# EAGLE design Filtering_stages (EAGLE 7.4.0)
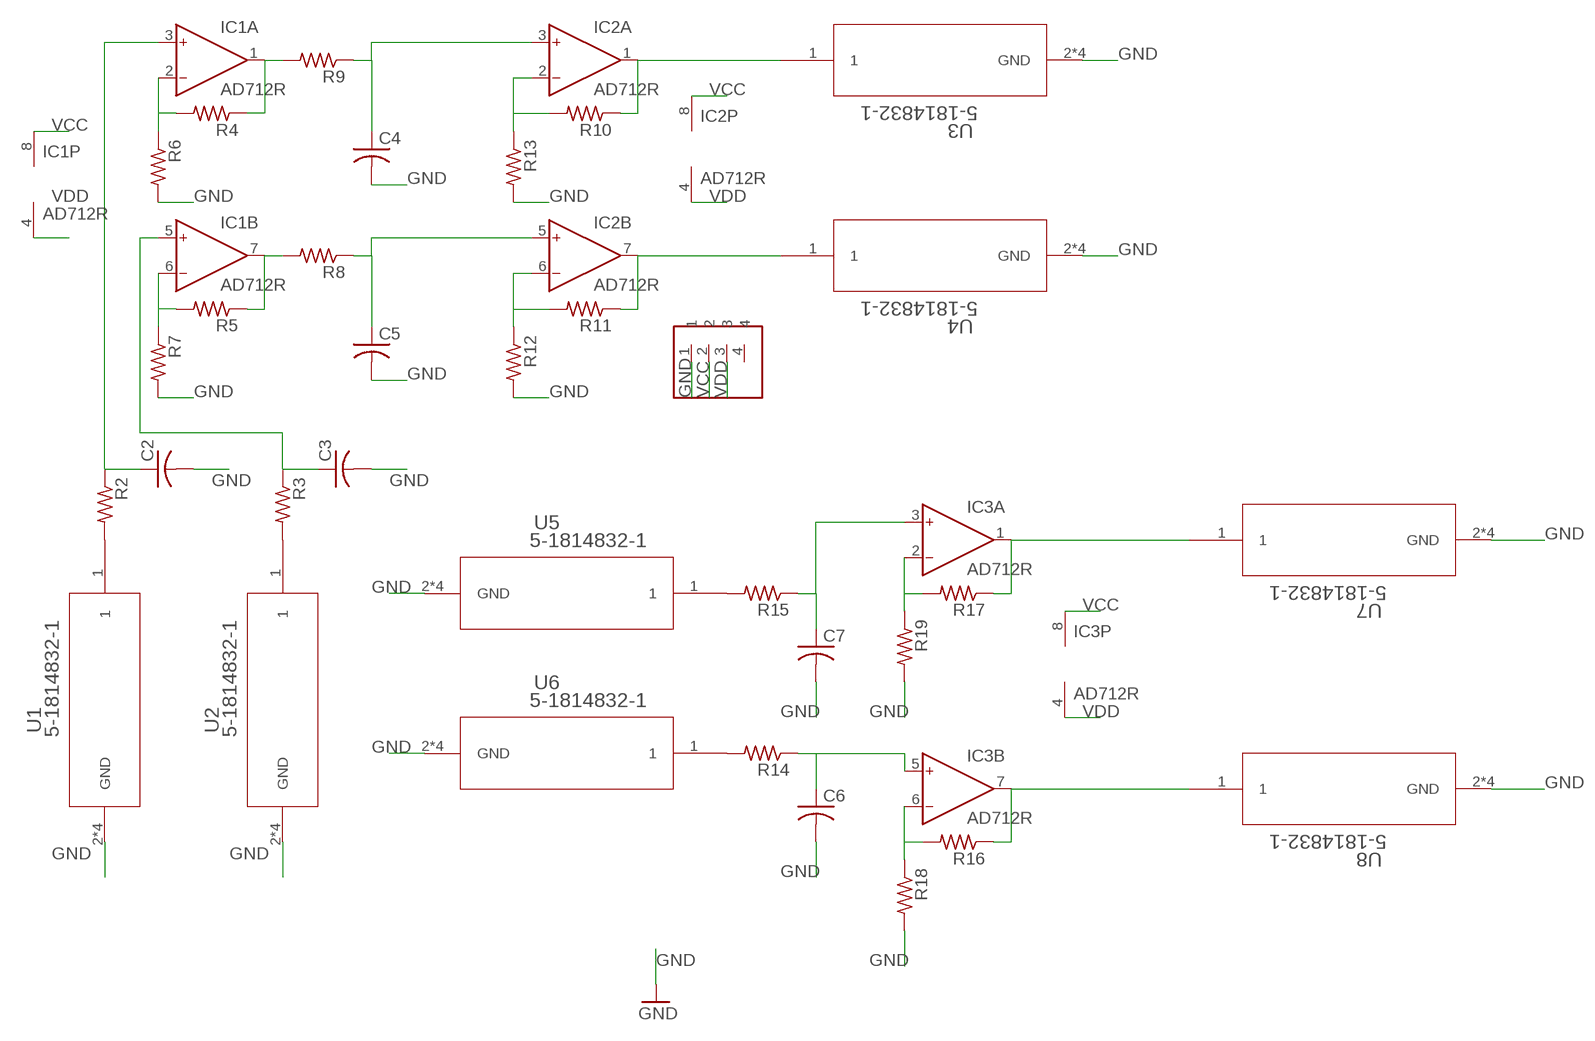
[diagram p0: schematic, sheet 1]

## Parts
C2  C-US025-025X050  [C025-025X050]
C3  C-US025-025X050  [C025-025X050]
C4  C-US025-025X050  [C025-025X050]
C5  C-US025-025X050  [C025-025X050]
C6  C-US025-025X050  [C025-025X050]
C7  C-US025-025X050  [C025-025X050]
IC1  AD712R  [SO8]
IC2  AD712R  [SO8]
IC3  AD712R  [SO8]
R2  R-US_0204/7  [0204/7]
R3  R-US_0204/7  [0204/7]
R4  R-US_0204/7  [0204/7]
R5  R-US_0204/7  [0204/7]
R6  R-US_0204/7  [0204/7]
R7  R-US_0204/7  [0204/7]
R8  R-US_0204/7  [0204/7]
R9  R-US_0204/7  [0204/7]
R10  R-US_0204/7  [0204/7]
R11  R-US_0204/7  [0204/7]
R12  R-US_0204/7  [0204/7]
R13  R-US_0204/7  [0204/7]
R14  R-US_0204/7  [0204/7]
R15  R-US_0204/7  [0204/7]
R16  R-US_0204/7  [0204/7]
R17  R-US_0204/7  [0204/7]
R18  R-US_0204/7  [0204/7]
R19  R-US_0204/7  [0204/7]
U1  5-1814832-1  [5-1814832-1]
U2  5-1814832-1  [5-1814832-1]
U3  5-1814832-1  [5-1814832-1]
U4  5-1814832-1  [5-1814832-1]
U5  5-1814832-1  [5-1814832-1]
U6  5-1814832-1  [5-1814832-1]
U7  5-1814832-1  [5-1814832-1]
U8  5-1814832-1  [5-1814832-1]
U$1  ED2582-ND  [ED2582-ND]

## Nets
GND: C2.2 C3.2 C4.2 C5.2 C6.2 C7.2 R6.2 R7.2 R12.2 R13.2 R18.2 R19.2 U1.2(GND) U1.3(GND) U1.4(GND) U1.5(GND) U2.2(GND) U2.3(GND) U2.4(GND) U2.5(GND) U3.2(GND) U3.3(GND) U3.4(GND) U3.5(GND) U4.2(GND) U4.3(GND) U4.4(GND) U4.5(GND) U5.2(GND) U5.3(GND) U5.4(GND) U5.5(GND) U6.2(GND) U6.3(GND) U6.4(GND) U6.5(GND) U7.2(GND) U7.3(GND) U7.4(GND) U7.5(GND) U8.2(GND) U8.3(GND) U8.4(GND) U8.5(GND) U$1.1
N$3: R2.2 U1.1
N$4: R3.2 U2.1
N$5: C2.1 IC1.3(A:IN+) R2.1
N$6: C3.1 IC1.5(B:IN+) R3.1
N$7: IC1.6(B:IN-) R5.2 R7.1
N$8: IC1.7(B:OUT) R5.1 R8.2
N$9: IC1.1(A:OUT) R4.1 R9.2
N$10: IC1.2(A:IN-) R4.2 R6.1
N$11: C4.1 IC2.3(A:IN+) R9.1
N$12: IC2.2(A:IN-) R10.2 R13.1
N$13: IC2.6(B:IN-) R11.2 R12.1
N$14: IC2.1(A:OUT) R10.1 U3.1
N$15: IC2.7(B:OUT) R11.1 U4.1
N$16: C5.1 IC2.5(B:IN+) R8.1
N$17: R14.2 U6.1
N$18: R15.2 U5.1
N$19: C7.1 IC3.3(A:IN+) R15.1
N$20: IC3.2(A:IN-) R17.2 R19.1
N$21: IC3.1(A:OUT) R17.1 U7.1
N$22: C6.1 IC3.5(B:IN+) R14.1
N$23: IC3.6(B:IN-) R16.2 R18.1
N$24: IC3.7(B:OUT) R16.1 U8.1
VCC: IC1.8(P:V+) IC2.8(P:V+) IC3.8(P:V+) U$1.2
VDD: IC1.4(P:V-) IC2.4(P:V-) IC3.4(P:V-) U$1.3
Unconnected: U$1.4

## Library data of the parts
C2-C7 = rcl:C-US: CAPACITOR, American symbol
IC1-IC3 = analog-devices:AD712: Dual Precision, Low Cost, High Speed BiFET Op Amp Source: http://www.analog.com/static/imported-files/data_sheets/AD712.pdf; MF: ALTERA CORPORATION; MPN: AD712KRZ; OC_FARNELL: 1263975; OC_NEWARK: 59K4556
R2-R19 = resistor:R-US_: RESISTOR, American symbol
U1-U8 = untitled:5-1814832-1; COPYRIGHT: Copyright (C) 2015 Accelerated Designs. All rights reserved; MANUFACTURER_PART_NUMBER: 5-1814832-1; VENDOR: Tyco Electronics
U$1 = addin:ED2582-ND

## Board
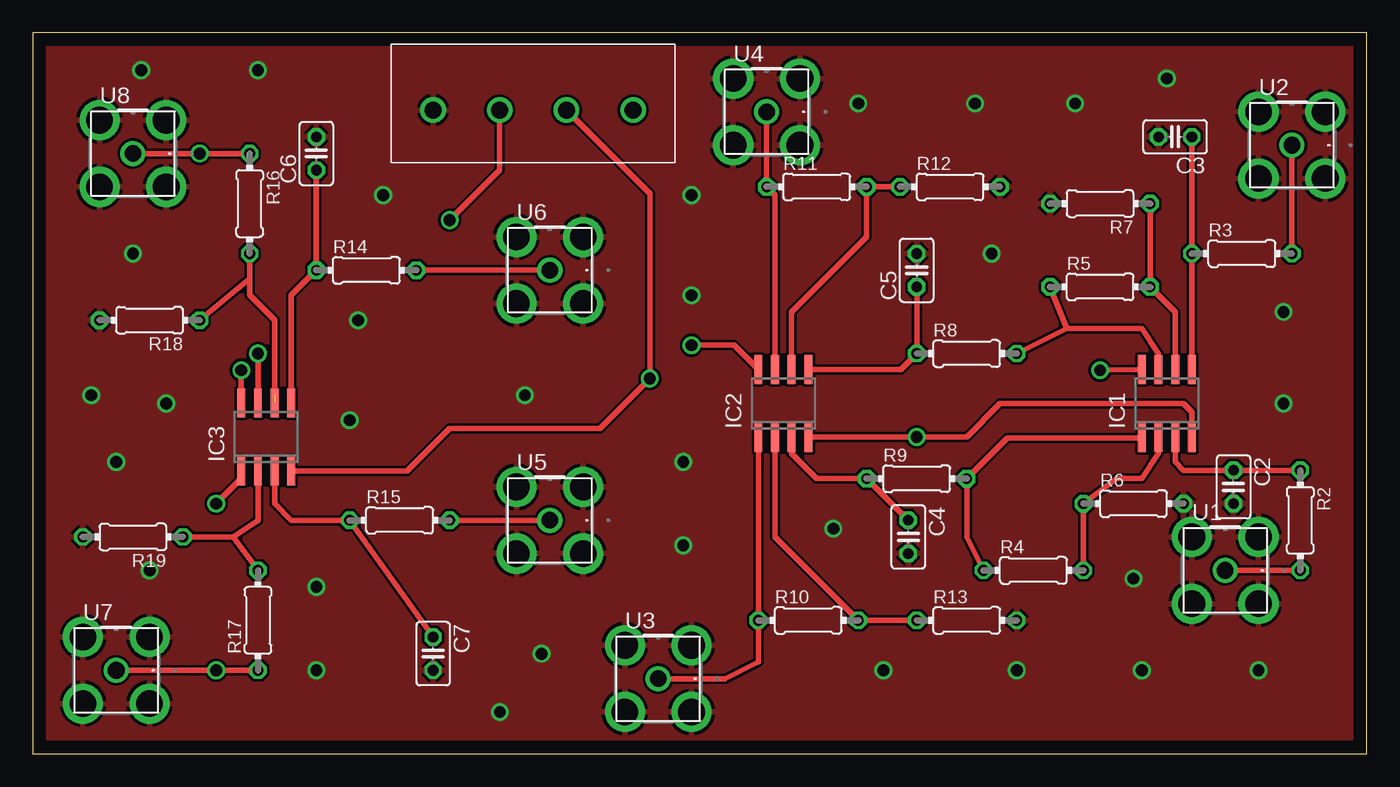
[diagram p1: board, top side]
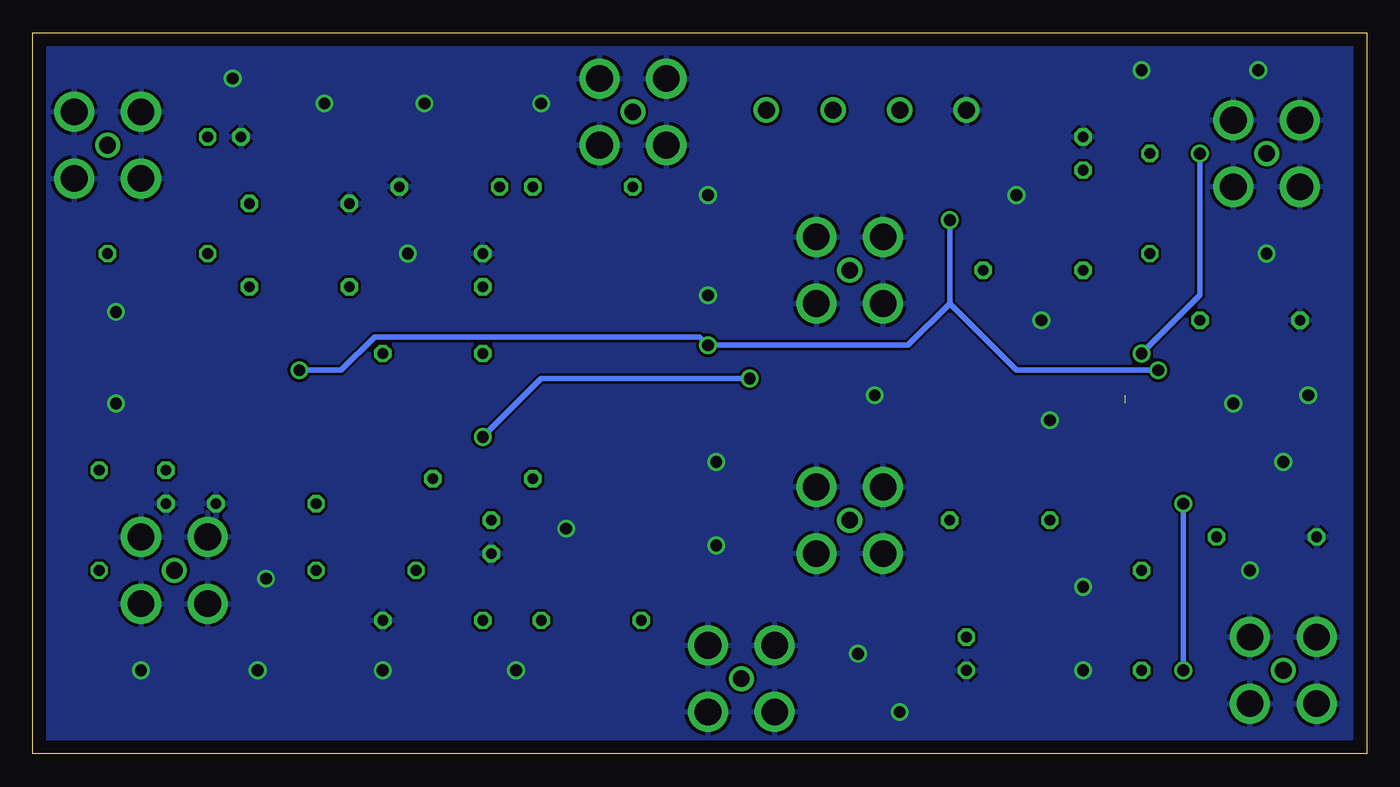
[diagram p2: board, bottom side, seen from below]

Size 101.58 x 54.91 mm. Coordinates in mm from the lower left corner, seen from the top.
Outline: 0,0 101.58,0 101.58,54.91 0,54.91 0,0
Copper layers (1*16): Top 0.035mm / dielectric 1.5mm / Bottom 0.035mm
Design rules "default": minimum track width 10mil, minimum drill 24mil, track to track 8mil, track to pad 8mil, pad to pad 8mil, via to via 8mil, smd to smd 8mil, copper to edge 40mil, drill to drill 8mil, minimum pad ring 10mil, minimum via ring 8mil, stop-mask expansion 4mil, vias tented up to drill 0mil, thermal gap 10mil

### Footprints (pad centres in the part's own frame; a part is rotated, then mirrored left to right if it is on the bottom)
C025-025X050 = drill 0.813 octagon: 1 -1.27,0; 2 1.27,0
SO8 = smd 0.6 x 2.2: 1 -1.905,-2.6; 2 -0.635,-2.6; 3 0.635,-2.6; 4 1.905,-2.6; 5 1.905,2.6; 6 0.635,2.6; 7 -0.635,2.6; 8 -1.905,2.6
0204/7 = drill 0.813 octagon: 1 -3.81,0; 2 3.81,0
5-1814832-1 = drill 1.27 pad 1.778: 1 0,0 | drill 2.032 pad 2.54: 2 -2.54,2.54; 3 -2.54,-2.54; 4 2.54,-2.54; 5 2.54,2.54
ED2582-ND = drill 1.3: 1 -7.62,-0.5; 2 -2.54,-0.5; 3 2.54,-0.5; 4 7.62,-0.5

### Placement (x,y rotation side)
C2  91.44,20.32 270 top
C3  87,46.99 180 top
C4  66.67,16.51 270 top
C5  67.31,36.83 90 top
C6  21.59,45.72 90 top
C7  30.48,7.62 270 top
IC1  86.36,26.67 0 top
IC2  57.15,26.67 0 top
IC3  17.78,24.13 0 top
R2  96.52,17.78 270 top
R3  92.08,38.1 0 top
R4  76.2,13.97 0 top
R5  81.28,35.56 0 top
R6  83.82,19.05 0 top
R7  81.28,41.91 180 top
R8  71.12,30.48 0 top
R9  67.31,20.95 0 top
R10  59.05,10.16 0 top
R11  59.69,43.18 0 top
R12  69.85,43.18 0 top
R13  71.12,10.16 0 top
R14  25.4,36.83 0 top
R15  27.94,17.78 0 top
R16  16.51,41.91 270 top
R17  17.14,10.16 90 top
R18  8.89,33.02 180 top
R19  7.62,16.51 180 top
U1  90.81,13.97 0 top
U2  95.89,46.35 0 top
U3  47.62,5.71 0 top
U4  55.88,48.9 0 top
U5  39.37,17.78 0 top
U6  39.37,36.83 0 top
U7  6.35,6.35 0 top
U8  7.62,45.72 0 top
U$1  38.1,49.53 0 top

### Tracks (layer width: path | path; a pad name or v marks a point on that pad's centre or on a via)
GND  (via drill 0.9)
  other vias: 8.26,52.07 17.14,52.07 26.67,42.55 7.62,38.1 4.45,27.3 10.16,26.67 6.35,22.23 21.59,12.7 21.59,6.35 8.89,13.97 24.13,25.4 37.47,27.3 24.77,33.02 49.53,22.23 49.53,15.88 38.73,7.62 50.16,34.92 50.16,42.55 62.87,49.53 71.75,49.53 79.38,49.53 86.36,51.44 73.03,38.1 95.25,33.66 95.25,26.67 83.82,13.34 93.34,6.35 84.45,6.35 74.93,6.35 64.77,6.35 60.96,17.14 35.56,3.17
  pour Bottom: -0.64,56.52 103.5,56.52 103.5,55.88 103.5,-1.27 -2.54,-1.27 -2.54,0.64 -3.17,0.64 -3.17,56.52
  pour Top: -3.17,56.52 102.87,56.52 102.87,55.24 102.87,-1.27 -3.17,-1.27
N$3
  Top 0.406: U1.1 R2.2
N$4
  Top 0.406: R3.2 U2.1
N$5
  Top 0.406: R2.1 C2.1 87.63,21.59 87,22.23 IC1.3
N$6
  Top 0.406: IC1.5 R3.1 C3.1
N$7
  Top 0.406: IC1.6 87,33.66 R5.2 R7.1
N$8
  Top 0.406: R8.2 78.74,32.38 | 78.74,32.38 R5.1 | 78.74,32.38 84.45,32.38 85.72,30.48 IC1.7
N$9
  Top 0.406: IC1.1 74.23,24.07 R9.2 71.12,16.51 R4.1
N$10
  Top 0.406: R4.2 R6.1 82.55,20.95 84.45,20.95 85.72,22.86 IC1.2
N$11
  Top 0.406: IC2.3 57.78,22.86 59.69,20.95 R9.1 C4.1
N$12
  Top 0.406: R13.1 R10.2 56.52,16.51 IC2.2
N$13
  Top 0.406: R12.1 R11.2 63.5,39.37 57.78,33.66 IC2.6
N$14
  Top 0.406: IC2.1 R10.1 55.24,6.99 52.7,5.71 U3.1
N$15
  Top 0.406: U4.1 R11.1 56.52,42.55 IC2.7
N$16
  Top 0.406: IC2.5 66.1,29.27 R8.1 C5.1
N$17
  Top 0.406: R14.2 U6.1
N$18
  Top 0.406: R15.2 U5.1
N$19
  Top 0.406: IC3.3 18.41,19.05 19.68,17.78 R15.1 C7.1
N$20
  Top 0.406: R19.1 15.24,16.51 | 15.24,16.51 R17.2 | 15.24,16.51 17.14,17.78 IC3.2
N$21  (via drill 0.9)
  Top 0.406: U7.1 v13.97,6.35 R17.1 | IC3.1 15.88,20.95 v13.97,19.05
  Bottom 0.406: v13.97,19.05 v13.97,6.35
N$22
  Top 0.406: IC3.5 19.68,34.92 R14.1 C6.1
N$23  (1 unrouted)
  Top 0.406: R16.2 16.51,36.83 16.51,36.2 | 16.51,36.2 R18.1 | 18.41,27.3 18.41,33.02 16.51,34.92 16.51,36.2
N$24  (via drill 0.9)
  Top 0.406: U8.1 v12.7,45.72 R16.1 | IC3.7 v17.14,30.48
  Bottom 0.406: v17.14,30.48 12.7,34.92 v12.7,45.72
VCC  (via drill 0.9)
  Top 0.406: U$1.2 35.56,44.45 v31.75,40.64 | v15.88,29.21 IC3.8 | IC2.8 53.4,31.11 v50.16,31.11 | IC1.8 v81.28,29.21
  Bottom 0.406: v31.75,40.64 31.75,34.29 | 31.75,34.29 26.67,29.21 v15.88,29.21 | 31.75,34.29 34.92,31.11 v50.16,31.11 50.8,31.75 75.56,31.75 78.11,29.21 v81.28,29.21
VDD  (via drill 0.9)
  Top 0.406: U$1.3 46.99,42.68 v46.99,28.57 43.18,24.77 31.75,24.77 28.52,21.53 IC3.4 | IC2.4 arc-90 59.12,24.13 v67.31,24.13 71.12,24.13 73.66,26.67 87.63,26.67 88.27,26.04 IC1.4
  Bottom 0.406: v46.99,28.57 62.87,28.57 v67.31,24.13